# Altium schematic sheet DRAM.SchDoc
size A; SheetNumber: 6; SheetTotal: 7
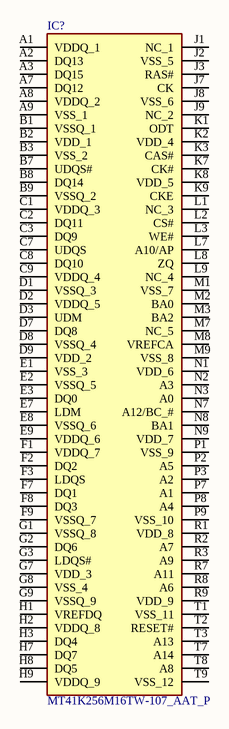
[diagram p0: DRAM.SchDoc]

## Parts
IC?  MT41K256M16TW-107_AAT_P  [BGA96C80P9X16_800X1400X120]

## Nets

Not connected (* = marked no-connect by the designer): IC? A1(VDDQ_1) A2(DQ13) A3(DQ15) A7(DQ12) A8(VDDQ_2) A9(VSS_1) B1(VSSQ_1) B2(VDD_1) B3(VSS_2) B7(UDQS#) B8(DQ14) B9(VSSQ_2) C1(VDDQ_3) C2(DQ11) C3(DQ9) C7(UDQS) C8(DQ10) C9(VDDQ_4) D1(VSSQ_3) D2(VDDQ_5) D3(UDM) D7(DQ8) D8(VSSQ_4) D9(VDD_2) E1(VSS_3) E2(VSSQ_5) E3(DQ0) E7(LDM) E8(VSSQ_6) E9(VDDQ_6) F1(VDDQ_7) F2(DQ2) F3(LDQS) F7(DQ1) F8(DQ3) F9(VSSQ_7) G1(VSSQ_8) G2(DQ6) G3(LDQS#) G7(VDD_3) G8(VSS_4) G9(VSSQ_9) H1(VREFDQ) H2(VDDQ_8) H3(DQ4) H7(DQ7) H8(DQ5) H9(VDDQ_9) J1(NC_1) J2(VSS_5) J3(RAS#) J7(CK) J8(VSS_6) J9(NC_2) K1(ODT) K2(VDD_4) K3(CAS#) K7(CK#) K8(VDD_5) K9(CKE) L1(NC_3) L2(CS#) L3(WE#) L7(A10/AP) L8(ZQ) L9(NC_4) M1(VSS_7) M2(BA0) M3(BA2) M7(NC_5) M8(VREFCA) M9(VSS_8) N1(VDD_6) N2(A3) N3(A0) N7(A12/BC_#) N8(BA1) N9(VDD_7) P1(VSS_9) P2(A5) P3(A2) P7(A1) P8(A4) P9(VSS_10) R1(VDD_8) R2(A7) R3(A9) R7(A11) R8(A6) R9(VDD_9) T1(VSS_11) T2(RESET#) T3(A13) T7(A14) T8(A8) T9(VSS_12)

## Library data of the parts
IC? = MT41K256M16TW-107_AAT_P: Integrated Circuit; Manufacturer_Name: Micron; Manufacturer_Part_Number: MT41K256M16TW-107 AAT:P; Datasheet Link: https://datasheet.datasheetarchive.com/originals/distributors/DKDS-31/603718.pdf; Height: 1.2mm; Mouser Part Number: 340-265867-TRAY; Mouser Price/Stock: https://www.mouser.co.uk/ProductDetail/Micron/MT41K256M16TW-107-AATP?qs=rrS6PyfT74fV7gIA5KoIHg%3D%3D; Arrow Part Number: MT41K256M16TW-107 AAT:P; Arrow Price/Stock: https://www.arrow.com/en/products/mt41k256m16tw-107-aatp/micron-technology?utm_currency=USD&region=europe